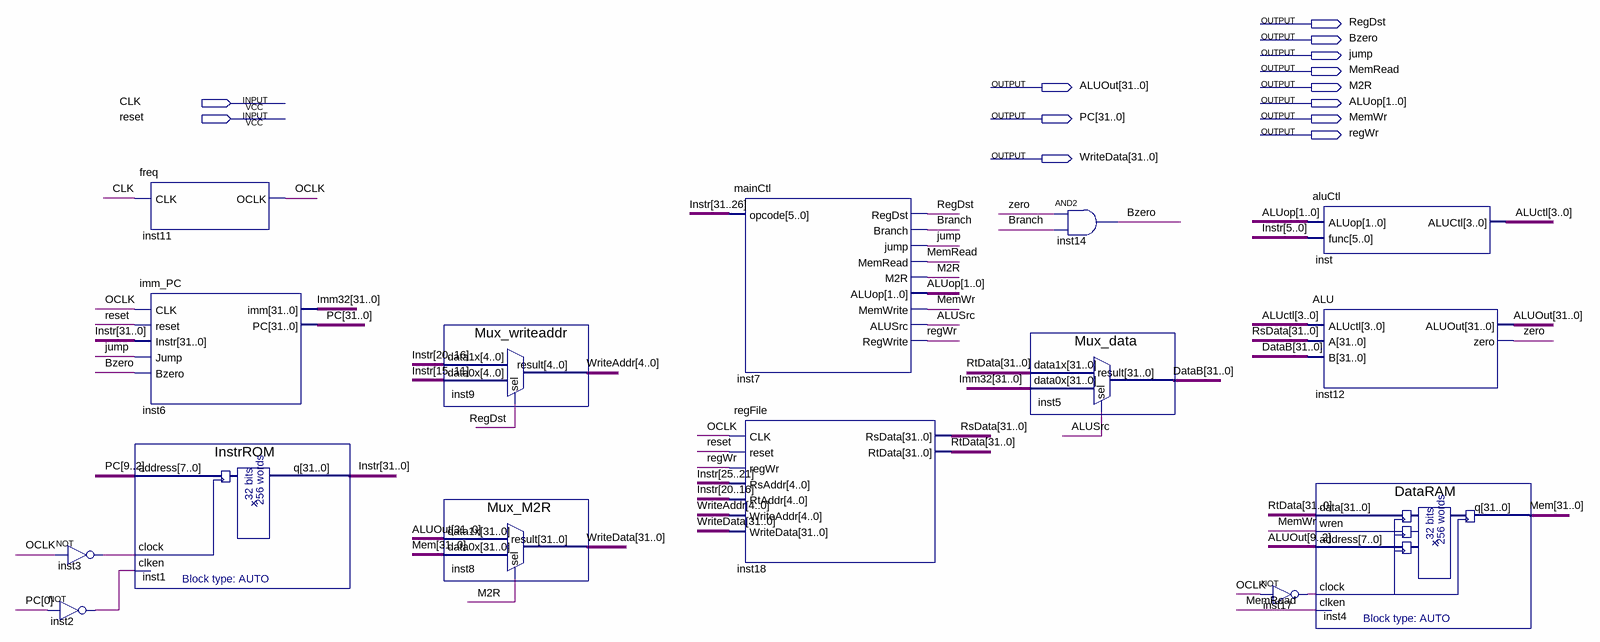
[diagram p0: schematic sheet]
// Quartus schematic SCPU.bdf as structural Verilog: 15 symbols, 13 pins
module SCPU (
  input  CLK,
  input  reset,
  output RegDst,
  output Bzero,
  output jump,
  output MemRead,
  output [31:0] ALUOut,
  output M2R,
  output [1:0] ALUop,
  output [31:0] PC,
  output MemWr,
  output regWr,
  output [31:0] WriteData
);

  wire ALUSrc, Branch, inst2_out, inst3_out, inst17_out, OCLK, zero;
  wire [3:0] ALUctl;
  wire [4:0] WriteAddr;
  wire [31:0] DataB, Imm32, Instr, Mem, RsData, RtData;

  not inst3 (inst3_out, OCLK);
  not inst2 (inst2_out, PC[0]);
  freq inst11 (.CLK(CLK), .OCLK(OCLK));
  imm_PC inst6 (.CLK(OCLK), .reset(reset), .Instr(Instr), .Jump(jump), .Bzero(Bzero), .imm(Imm32), .PC(PC));
  InstrROM inst1 (.address(PC[9:2]), .clock(inst3_out), .clken(inst2_out), .q(Instr));
  Mux_writeaddr inst9 (.data1x(Instr[20:16]), .data0x(Instr[15:11]), .sel(RegDst), .result(WriteAddr));
  Mux_M2R inst8 (.data1x(ALUOut), .data0x(Mem), .sel(M2R), .result(WriteData));
  mainCtl inst7 (
    .opcode(Instr[31:26]), .RegDst(RegDst), .Branch(Branch), .jump(jump), .MemRead(MemRead), .M2R(M2R),
    .ALUop(ALUop), .MemWrite(MemWr), .ALUSrc(ALUSrc), .RegWrite(regWr));
  regFile inst18 (
    .CLK(OCLK), .reset(reset), .regWr(regWr), .RsAddr(Instr[25:21]), .RtAddr(Instr[20:16]),
    .WriteAddr(WriteAddr), .WriteData(WriteData), .RsData(RsData), .RtData(RtData));
  Mux_data inst5 (.data1x(RtData), .data0x(Imm32), .sel(ALUSrc), .result(DataB));
  and inst14 (Bzero, zero, Branch);
  not inst17 (inst17_out, OCLK);
  aluCtl inst (.ALUop(ALUop), .func(Instr[5:0]), .ALUCtl(ALUctl));
  ALU inst12 (.ALUctl(ALUctl), .A(RsData), .B(DataB), .ALUOut(ALUOut), .zero(zero));
  DataRAM inst4 (.data(RtData), .wren(MemWr), .address(ALUOut[9:2]), .clock(inst17_out), .clken(MemRead), .q(Mem));
endmodule
